# EAGLE design TinyBot (EAGLE 5.10)
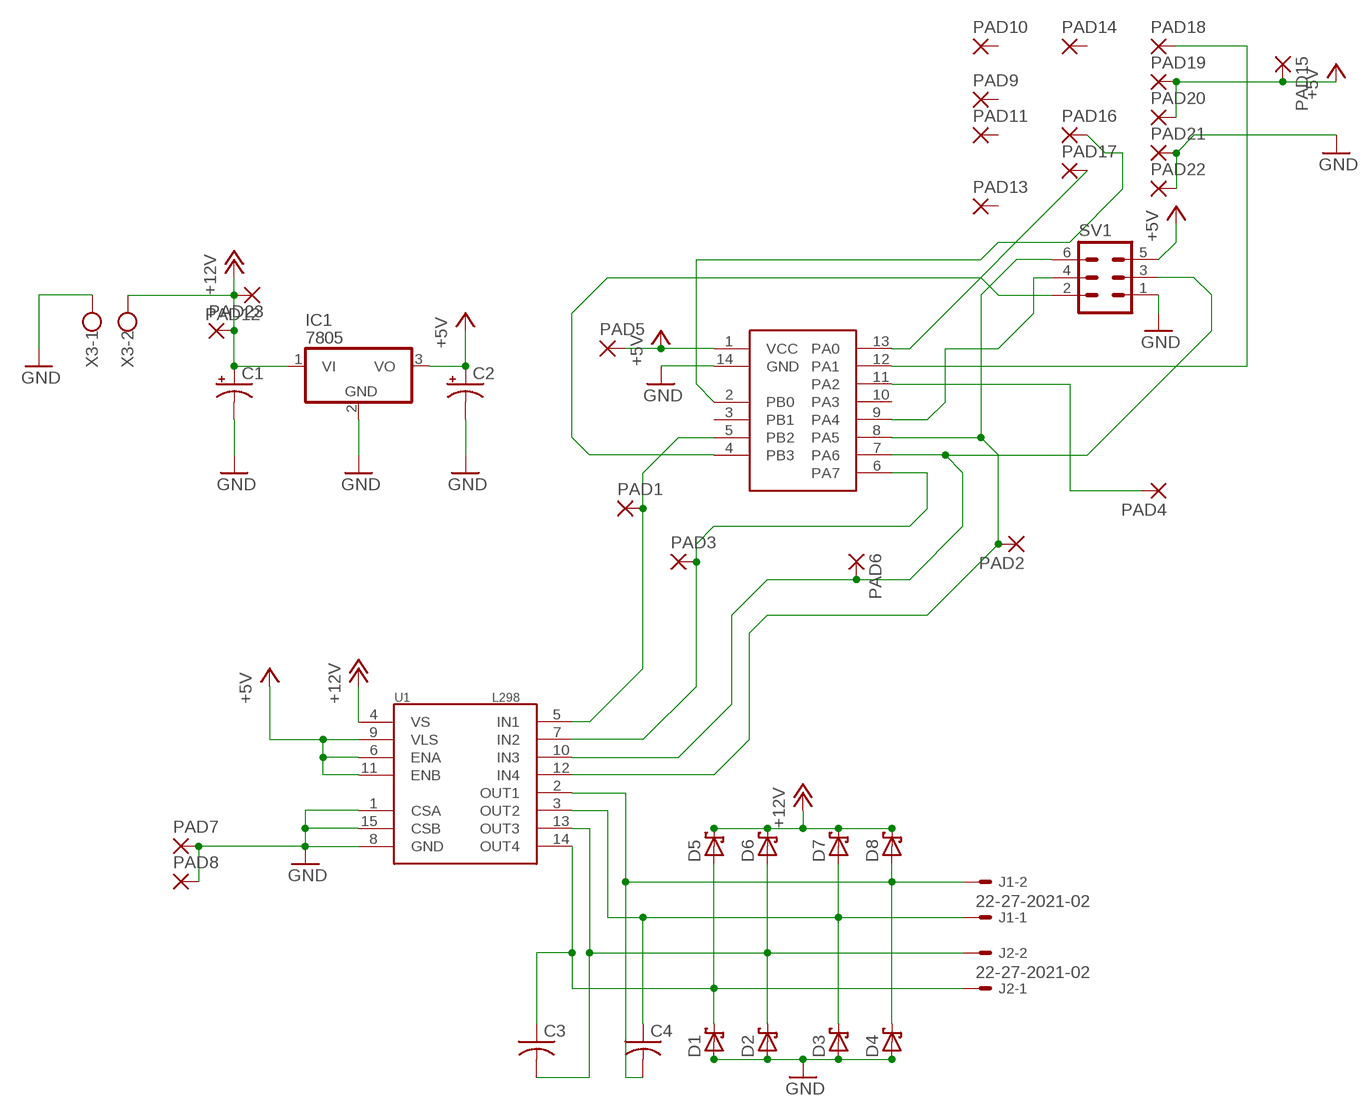
[diagram p0: schematic, sheet 1]

## Parts
C1  CPOL-USE2.5-6  [E2,5-6]
C2  CPOL-USE2.5-6  [E2,5-6]
C3  C-US025-030X050  [C025-030X050]
C4  C-US025-030X050  [C025-030X050]
D1  SCHOTTKY-DIODEF126Z12  [F126Z12]
D2  SCHOTTKY-DIODEF126Z12  [F126Z12]
D3  SCHOTTKY-DIODEF126Z12  [F126Z12]
D4  SCHOTTKY-DIODEF126Z12  [F126Z12]
D5  SCHOTTKY-DIODEF126Z12  [F126Z12]
D6  SCHOTTKY-DIODEF126Z12  [F126Z12]
D7  SCHOTTKY-DIODEF126Z12  [F126Z12]
D8  SCHOTTKY-DIODEF126Z12  [F126Z12]
IC1  7805  7805TV  [TO220V]
J1  22-27-2021-02  [6410-02]
J2  22-27-2021-02  [6410-02]
PAD1  2,54/0,8  [2,54/0,8]
PAD2  2,54/0,8  [2,54/0,8]
PAD3  2,54/0,8  [2,54/0,8]
PAD4  2,54/0,8  [2,54/0,8]
PAD5  2,54/0,8  [2,54/0,8]
PAD6  2,54/0,8  [2,54/0,8]
PAD7  2,54/0,8  [2,54/0,8]
PAD8  2,54/0,8  [2,54/0,8]
PAD9  2,54/0,8  [2,54/0,8]
PAD10  2,54/0,8  [2,54/0,8]
PAD11  2,54/0,8  [2,54/0,8]
PAD12  2,54/0,8  [2,54/0,8]
PAD13  2,54/0,8  [2,54/0,8]
PAD14  2,54/0,8  [2,54/0,8]
PAD15  2,54/0,8  [2,54/0,8]
PAD16  2,54/0,8  [2,54/0,8]
PAD17  2,54/0,8  [2,54/0,8]
PAD18  2,54/0,8  [2,54/0,8]
PAD19  2,54/0,8  [2,54/0,8]
PAD20  2,54/0,8  [2,54/0,8]
PAD21  2,54/0,8  [2,54/0,8]
PAD22  2,54/0,8  [2,54/0,8]
PAD23  2,54/0,8  [2,54/0,8]
SV1  MA03-2  [MA03-2]
U1  L298  [MULTIWATT15]
U$5  ATTINY84  [DIL14]
X3  W237-102  [W237-102]

## Nets
+5V: C2.+ IC1.3(VO) PAD5.1(P) PAD15.1(P) PAD19.1(P) PAD20.1(P) SV1.5 U1.6(ENA) U1.9(VLS) U1.11(ENB) U$5.1(VCC)
+12V [Thick]: C1.+ D5.C D6.C D7.C D8.C IC1.1(VI) PAD12.1(P) PAD23.1(P) U1.4(VS) X3.2
GND: C1.- C2.- D1.A D2.A D3.A D4.A IC1.2(GND) PAD7.1(P) PAD8.1(P) PAD21.1(P) PAD22.1(P) SV1.1 U1.1(CSA) U1.8(GND) U1.15(CSB) U$5.14(GND) X3.1
INPUT2: PAD3.1(P) U1.7(IN2) U$5.6(PA7)
INPUT3: PAD6.1(P) SV1.3 U1.10(IN3) U$5.7(PA6)
INPUT4: PAD2.1(P) SV1.6 U1.12(IN4) U$5.8(PA5)
N$1: SV1.2 U$5.4(PB3)
N$2: PAD1.1(P) U1.5(IN1) U$5.5(PB2)
N$3: SV1.4 U$5.9(PA4)
N$4: PAD16.1(P) U$5.2(PB0)
N$5: PAD17.1(P) U$5.13(PA0)
N$6: PAD18.1(P) U$5.12(PA1)
N$7: PAD4.1(P) U$5.11(PA2)
OUT1: C4.2 D4.C D8.A J1.2 U1.2(OUT1)
OUT2: C4.1 D3.C D7.A J1.1 U1.3(OUT2)
OUT3: C3.2 D2.C D6.A J2.2 U1.13(OUT3)
OUT4: C3.1 D1.C D5.A J2.1 U1.14(OUT4)
Unconnected: PAD9.1(P) PAD10.1(P) PAD11.1(P) PAD13.1(P) PAD14.1(P) U$5.3(PB1) U$5.10(PA3)

## Library data of the parts
C1 C2 = rcl:CPOL-US: POLARIZED CAPACITOR, American symbol
C3 C4 = rcl:C-US: CAPACITOR, American symbol
D1-D8 = diode:SCHOTTKY-DIODE: Schottky Diode
IC1 = linear:78*: Positive VOLTAGE REGULATOR Source: http://cache.national.com/ds/LM/LM78L05.pdf http://www.fairchildsemi.com/ds/LM/LM7805.pdf
J1 J2 = con-molex:22-?-02: CONNECTOR wire to board 2.54 mm (.1 inch) pitch header; OC_FARNELL: unknown; OC_NEWARK: unknown
PAD1-PAD23 = wirepad:2,54/0,8: THROUGH-HOLE PAD
SV1 = con-lstb:MA03-2: PIN HEADER; OC_FARNELL: unknown; OC_NEWARK: unknown
U1 = SparkFun:L298: L298 Dual Full Bridge Driver
U$5 = ATTINY84:ATTINY84
X3 = con-wago-500:W237-102: WAGO SCREW CLAMP; MPN: 237-102; OC_FARNELL: unknown; OC_NEWARK: 70K9898

## Net classes
1 Thick: width 1.016 mm, drill 1.016 mm, clearance 0.508 mm

## Board
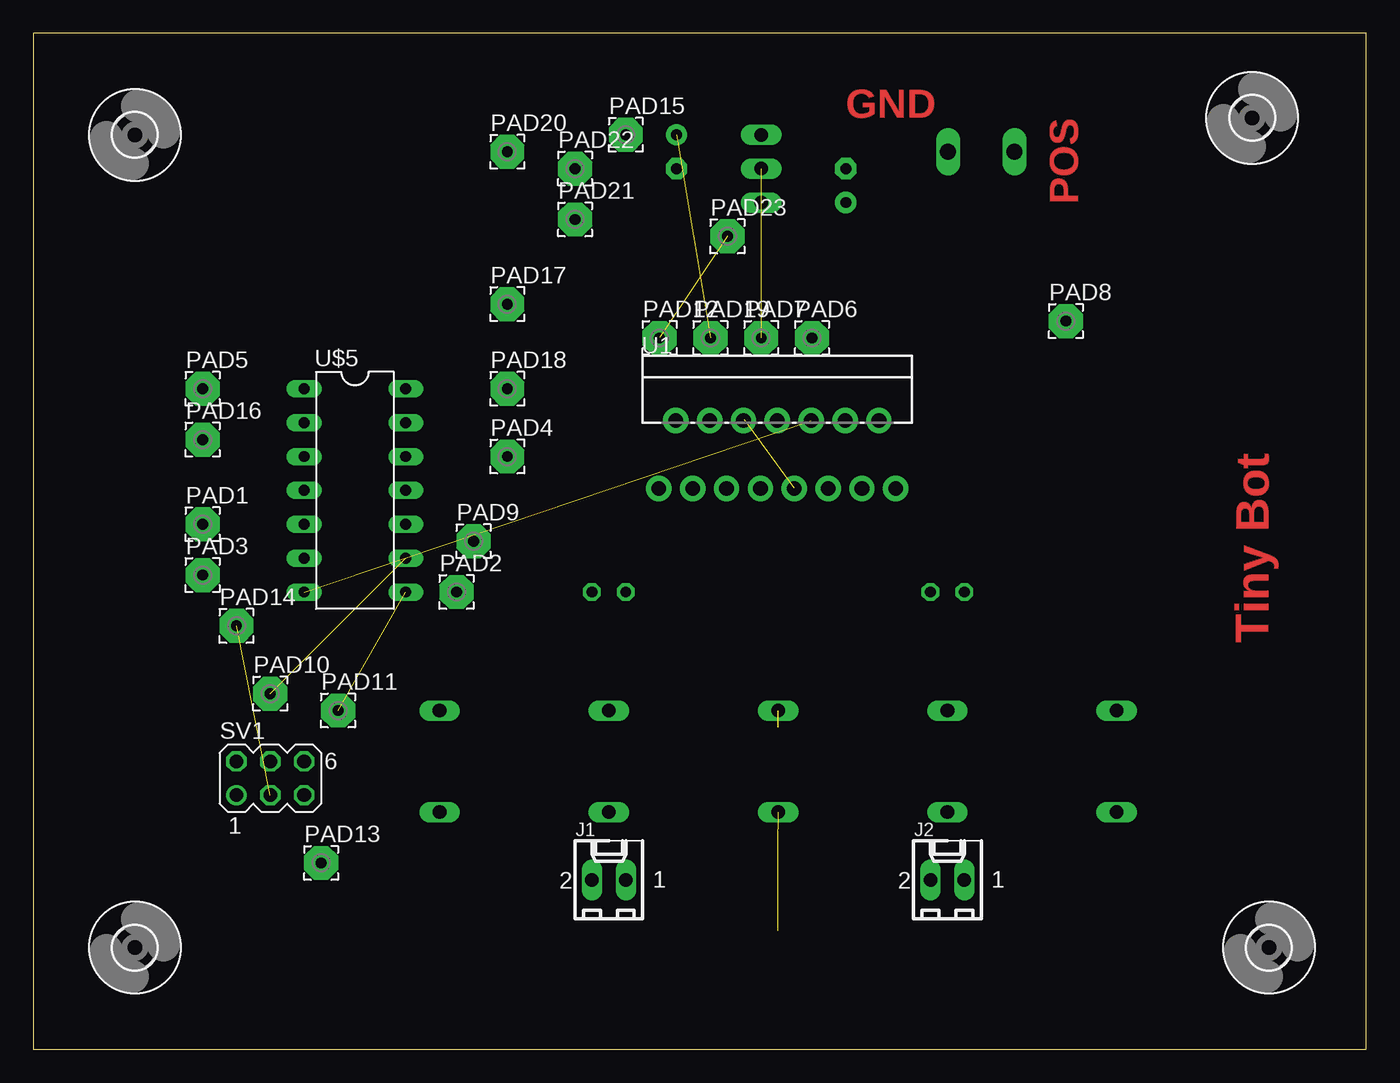
[diagram p1: board, top side]
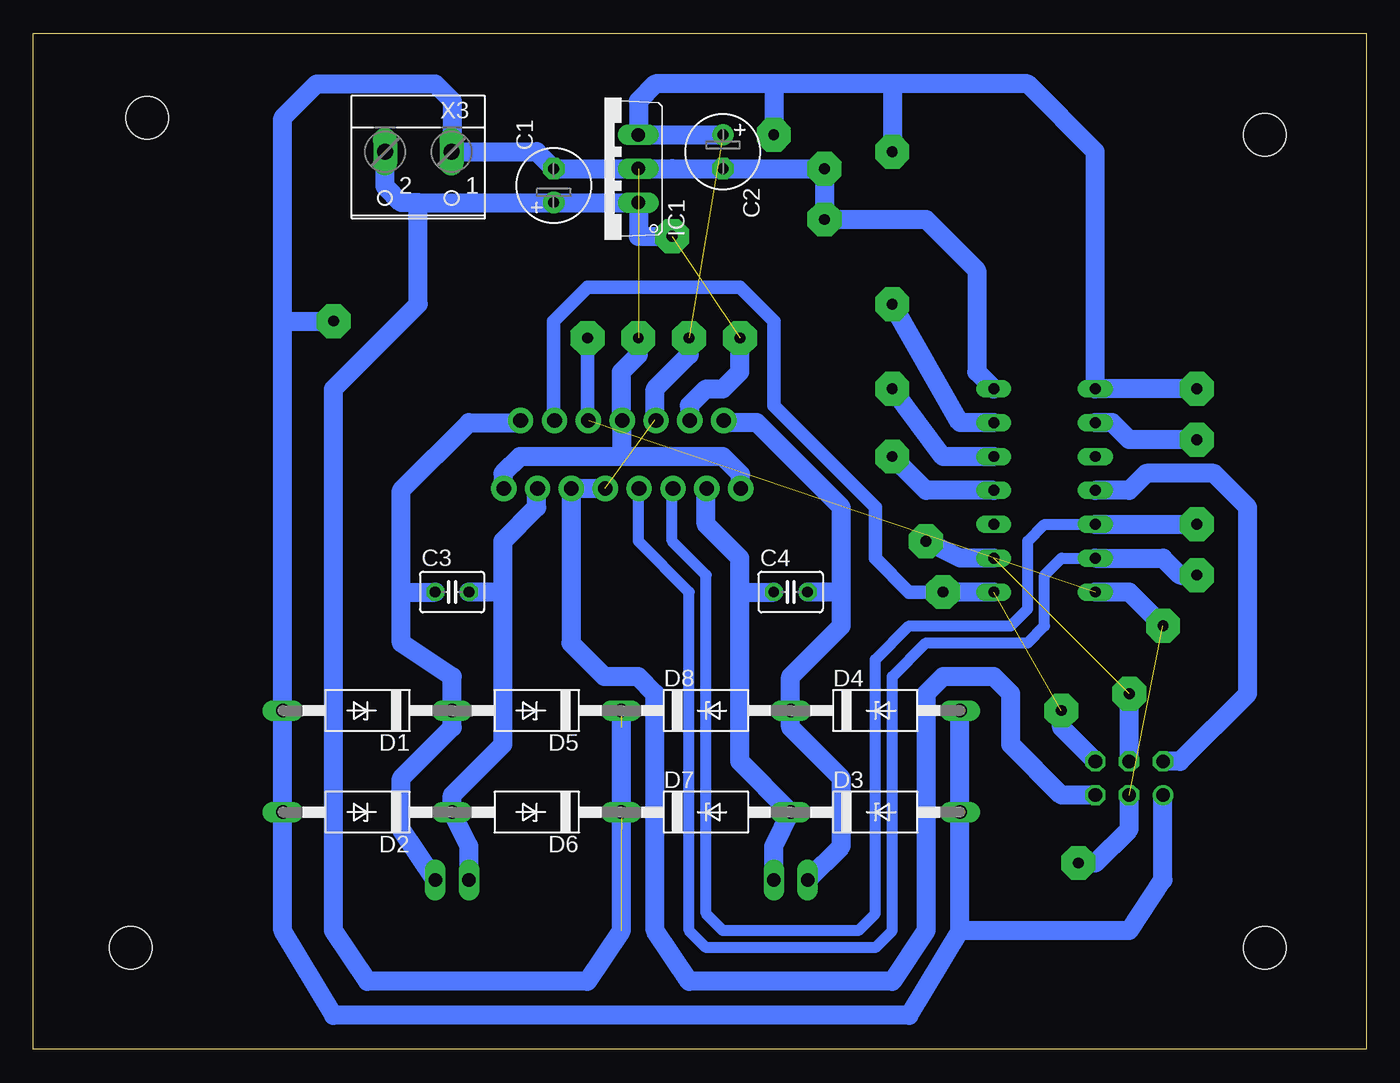
[diagram p2: board, bottom side, seen from below]

Size 100 x 76.19 mm. Coordinates in mm from the lower left corner, seen from the top.
Outline: 0,0 100,0 100,76.19 0,76.19 0,0
Copper layers (1*16): Top 0.035mm / dielectric 1.5mm / Bottom 0.035mm
Design rules "default": minimum track width 10mil, minimum drill 24mil, track to track 8mil, track to pad 8mil, pad to pad 8mil, via to via 8mil, smd to smd 8mil, copper to edge 40mil, drill to drill 8mil, minimum pad ring 10mil, minimum via ring 8mil, stop-mask expansion 4mil, vias tented up to drill 0mil, thermal gap 10mil

### Footprints (pad centres in the part's own frame; a part is rotated, then mirrored left to right if it is on the bottom)
E2,5-6 = drill 0.813 pad 1.6: + -1.27,0 | drill 0.813 pad 1.6 octagon: - 1.27,0
C025-030X050 = drill 0.813 octagon: 1 -1.27,0; 2 1.27,0
F126Z12 = drill 1.016 long: A 6.35,0; C -6.35,0
TO220V = drill 1.016 long: 1 -2.54,-2.54; 2 0,-2.54; 3 2.54,-2.54
6410-02 = drill 1.016 long: 1 1.27,0; 2 -1.27,0
2,54/0,8 = drill 0.813 pad 2.54 octagon: 1 0,0
MA03-2 = drill 1.016: 1 -2.54,-1.27 | drill 1.016 octagon: 2 -2.54,1.27; 3 0,-1.27; 4 0,1.27; 5 2.54,-1.27; 6 2.54,1.27
MULTIWATT15 = drill 1.1 pad 1.9: 1 -8.95,-2.39; 2 -7.68,2.69; 3 -6.41,-2.39; 4 -5.14,2.69; 5 -3.87,-2.39; 6 -2.6,2.69; 7 -1.33,-2.39; 8 -0.06,2.69; 9 1.21,-2.39; 10 2.48,2.69; 11 3.75,-2.39; 12 5.02,2.69; 13 6.29,-2.39; 14 7.56,2.69; 15 8.83,-2.39
3,2 = hole 3.2: 0,0
DIL14 = drill 0.813 long: 1 -7.62,-3.81; 2 -5.08,-3.81; 3 -2.54,-3.81; 4 0,-3.81; 5 2.54,-3.81; 6 5.08,-3.81; 7 7.62,-3.81; 8 7.62,3.81; 9 5.08,3.81; 10 2.54,3.81; 11 0,3.81; 12 -2.54,3.81; 13 -5.08,3.81; 14 -7.62,3.81
W237-102 = drill 1.194 long: 1 -2.5,-1.27; 2 2.5,-1.27

### Placement (x,y rotation side)
C1  60.96,64.77 90 bottom
C2  48.26,67.31 270 bottom
C3  68.58,34.29 0 bottom
C4  43.18,34.29 0 bottom
D1  74.93,25.4 180 bottom
D2  74.93,17.78 180 bottom
D3  36.83,17.78 0 bottom
D4  36.83,25.4 0 bottom
D5  62.23,25.4 180 bottom
D6  62.23,17.78 180 bottom
D7  49.53,17.78 0 bottom
D8  49.53,25.4 0 bottom
IC1  57.15,66.04 90 bottom
J1  43.18,12.7 0 top
J2  68.58,12.7 0 top
PAD1  12.7,39.37 0 top
PAD2  31.75,34.29 0 top
PAD3  12.7,35.56 0 top
PAD4  35.56,44.45 0 top
PAD5  12.7,49.53 0 top
PAD6  58.42,53.34 0 top
PAD7  54.61,53.34 0 top
PAD8  77.47,54.61 0 top
PAD9  33.02,38.1 0 top
PAD10  17.78,26.67 0 top
PAD11  22.86,25.4 0 top
PAD12  46.99,53.34 0 top
PAD13  21.59,13.97 0 top
PAD14  15.24,31.75 0 top
PAD15  44.45,68.58 0 top
PAD16  12.7,45.72 0 top
PAD17  35.56,55.88 0 top
PAD18  35.56,49.53 0 top
PAD19  50.8,53.34 0 top
PAD20  35.56,67.31 0 top
PAD21  40.64,62.23 0 top
PAD22  40.64,66.04 0 top
PAD23  52.07,60.96 0 top
SV1  17.78,20.32 0 top
U1  55.88,44.45 0 top
U$1  [3,2]  7.62,68.58 0 top
U$2  [3,2]  92.71,7.62 0 top
U$3  [3,2]  7.62,7.62 0 top
U$4  [3,2]  91.44,69.85 0 top
U$5  24.13,41.91 270 top
X3  71.12,66.04 180 bottom

### Tracks (layer width: path | path; a pad name or v marks a point on that pad's centre or on a via)
+5V  (2 unrouted)
  Bottom 1.422: C2.+ IC1.3 54.61,71.12 53.34,72.39 44.45,72.39 | 35.56,72.39 25.4,72.39 20.32,67.31 U$5.1 PAD5.1 | 35.56,72.39 44.45,72.39 | SV1.5 22.86,19.05 26.67,22.86 26.67,26.67 27.94,27.94 31.75,27.94 33.02,26.67 33.02,8.89 35.56,5.08 50.8,5.08 53.34,8.89 53.34,26.67 54.61,27.94 57.15,27.94 59.69,30.48 59.63,30.54 U1.11 U1.9 | 35.56,72.39 PAD20.1 | PAD19.1 50.8,52.07 53.34,49.53 53.34,47.2 U1.6 | 44.45,72.39 PAD15.1
+12V  (5 unrouted)
  Bottom 1.422: X3.2 73.62,64.73 72.39,63.5 71.12,63.5 | 71.12,63.5 C1.+ IC1.1 54.61,60.96 PAD23.1 | 71.12,63.5 71.12,55.88 77.47,49.53 77.47,8.89 74.93,5.08 58.42,5.08 55.88,8.89 D8.C | U1.4 50.74,48.2 50.8,48.26 49.53,49.53 48.26,49.53 46.99,50.8 PAD12.1
GND  (1 unrouted)
  Bottom 1.422: 68.58,67.31 62.23,67.31 C1.- IC1.2 | 68.58,67.31 X3.1 | IC1.2 C2.- PAD22.1 PAD21.1 33.02,62.23 29.21,58.42 29.21,50.8 U$5.14 | 81.28,54.61 81.28,69.85 78.74,72.39 69.85,72.39 68.58,71.12 68.58,67.31 | IC1.2 52.07,66.04 | 30.48,8.89 34.29,2.54 77.47,2.54 81.28,8.89 D2.A D1.A 81.28,54.61 | 81.28,54.61 PAD8.1 | SV1.1 15.24,12.7 17.78,8.89 30.48,8.89 | U1.1 46.93,43.12 48.26,44.45 55.88,44.45 | 55.88,44.45 63.5,44.45 64.77,43.18 64.77,42.12 U1.15 | 30.48,8.89 D3.A D4.A | 55.88,44.45 55.82,44.51 U1.8 55.88,47.2 55.88,50.8 54.61,52.07 PAD7.1
INPUT2
  Bottom 0.813: U$5.6 22.86,36.83 24.13,35.56 24.13,31.75 25.4,30.48 33.02,30.48 35.56,27.94 35.56,8.89 36.83,7.62 49.53,7.62 50.8,8.89 50.8,34.29 54.61,38.1 54.61,42 U1.7
  Bottom 1.422: U$5.6 15.24,36.83 13.97,35.56 PAD3.1
INPUT3  (2 unrouted)
  Bottom 1.016: PAD6.1 58.42,47.2 U1.10
  Bottom 1.422: SV1.3 17.78,16.51 20.32,13.97 21.59,13.97 | U$5.7 17.78,34.29 15.24,31.75
INPUT4  (1 unrouted)
  Bottom 1.016: PAD2.1 34.29,34.29 36.83,36.83 36.83,40.64 44.45,48.26 44.45,54.61 46.99,57.15 58.42,57.15 60.96,54.61 60.96,47.2 U1.12
  Bottom 1.422: SV1.6 22.86,24.13 22.86,25.4 | U$5.8 PAD2.1
N$1
  Bottom 1.422: U$5.4 17.78,41.91 16.51,43.18 11.43,43.18 8.89,40.64 8.89,26.67 13.97,21.59 SV1.2
N$2
  Bottom 0.813: U$5.5 24.13,39.37 25.4,38.1 25.4,33.02 26.67,31.75 34.29,31.75 36.83,29.21 36.83,10.16 38.1,8.89 48.26,8.89 49.53,10.16 49.53,35.56 52.07,38.1 52.07,42
  Bottom 1.422: U$5.5 PAD1.1 | 52.07,42 U1.5
N$3  (1 unrouted)
  Bottom 1.422: SV1.4 17.78,26.67 | U$5.9 30.48,36.83 33.02,38.1
N$4
  Bottom 1.422: PAD16.1 17.78,45.72 19.05,46.99 U$5.2
N$5
  Bottom 1.422: U$5.13 30.48,46.99 PAD17.1
N$6
  Bottom 1.422: U$5.12 31.75,44.45 PAD18.1
N$7
  Bottom 1.422: U$5.11 33.02,41.91 PAD4.1
OUT1
  Bottom 1.422: 39.37,34.29 39.37,31.75 43.18,27.94 D8.A 43.18,24.13 39.37,20.32 39.37,15.24 J1.2 | 39.37,34.29 39.37,40.64 45.72,46.99 48.05,46.99 U1.2 | 39.37,34.29 C4.2
OUT2
  Bottom 1.422: J1.1 44.45,15.24 D7.A 46.99,21.59 46.99,34.29 | 46.99,34.29 46.99,36.83 49.53,39.37 49.53,42 U1.3 | 46.99,34.29 C4.1
OUT3
  Bottom 1.422: J2.2 67.31,15.24 D6.A 68.58,19.05 64.77,22.86 64.77,34.29 | 64.77,34.29 64.77,38.1 62.23,40.64 62.23,42 U1.13 | 64.77,34.29 C3.2
OUT4
  Bottom 1.422: J2.1 72.39,16.51 72.39,20.32 68.58,24.13 D5.A 68.58,27.94 72.39,30.48 72.39,34.29 | 72.39,34.29 72.39,41.91 67.31,46.99 63.59,46.99 U1.14 | 72.39,34.29 C3.1

### Text on the board
Top: GND | POS | Tiny Bot